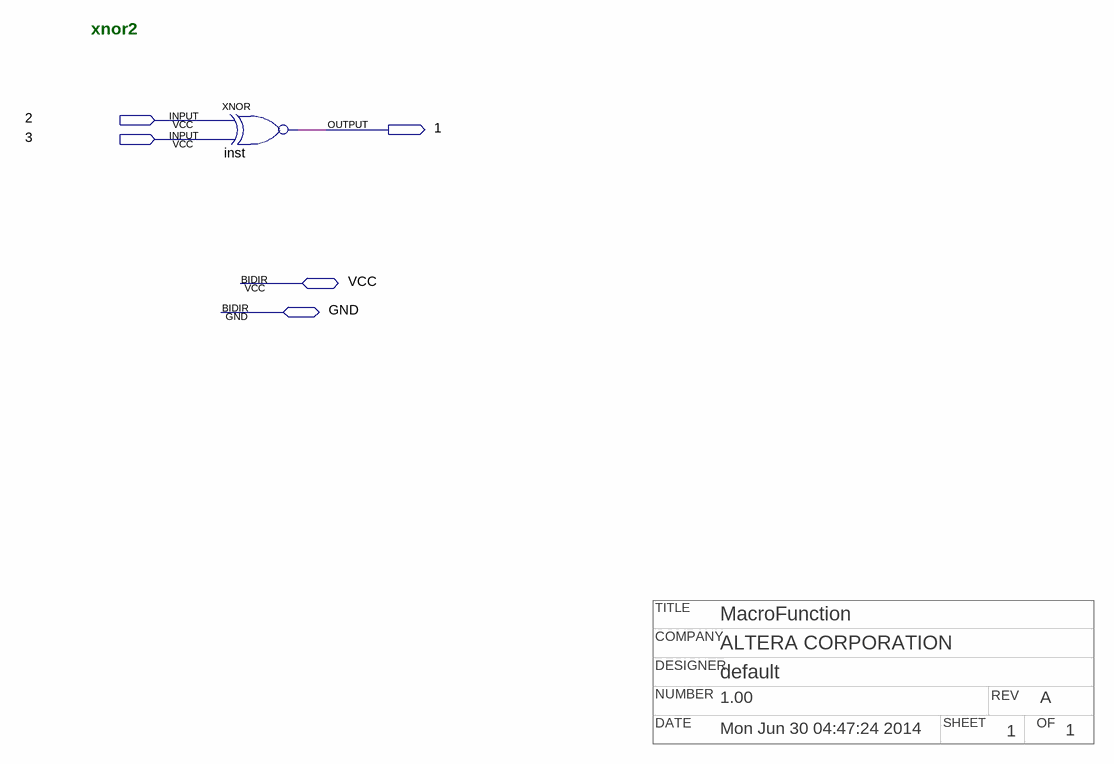
[diagram p0: schematic sheet]
// Quartus schematic npxnor2.bdf as structural Verilog: 1 symbols, 5 pins
// Title block: TITLE: MacroFunction; COMPANY: ALTERA CORPORATION; DESIGNER: default; NUMBER: 1.00; REV: A; DATE: Mon Jun 30 04:47:24 2014; SHEET: 1; OF: 1
module npxnor2 (
  input  \2 ,
  input  \3 ,
  inout  VCC,
  inout  GND,
  output \1 
);

  xnor inst (\1 , \2 , \3 );

  // Notes on the sheet:
  //   xnor2
endmodule
